# Altium project box_NU.PrjPCB
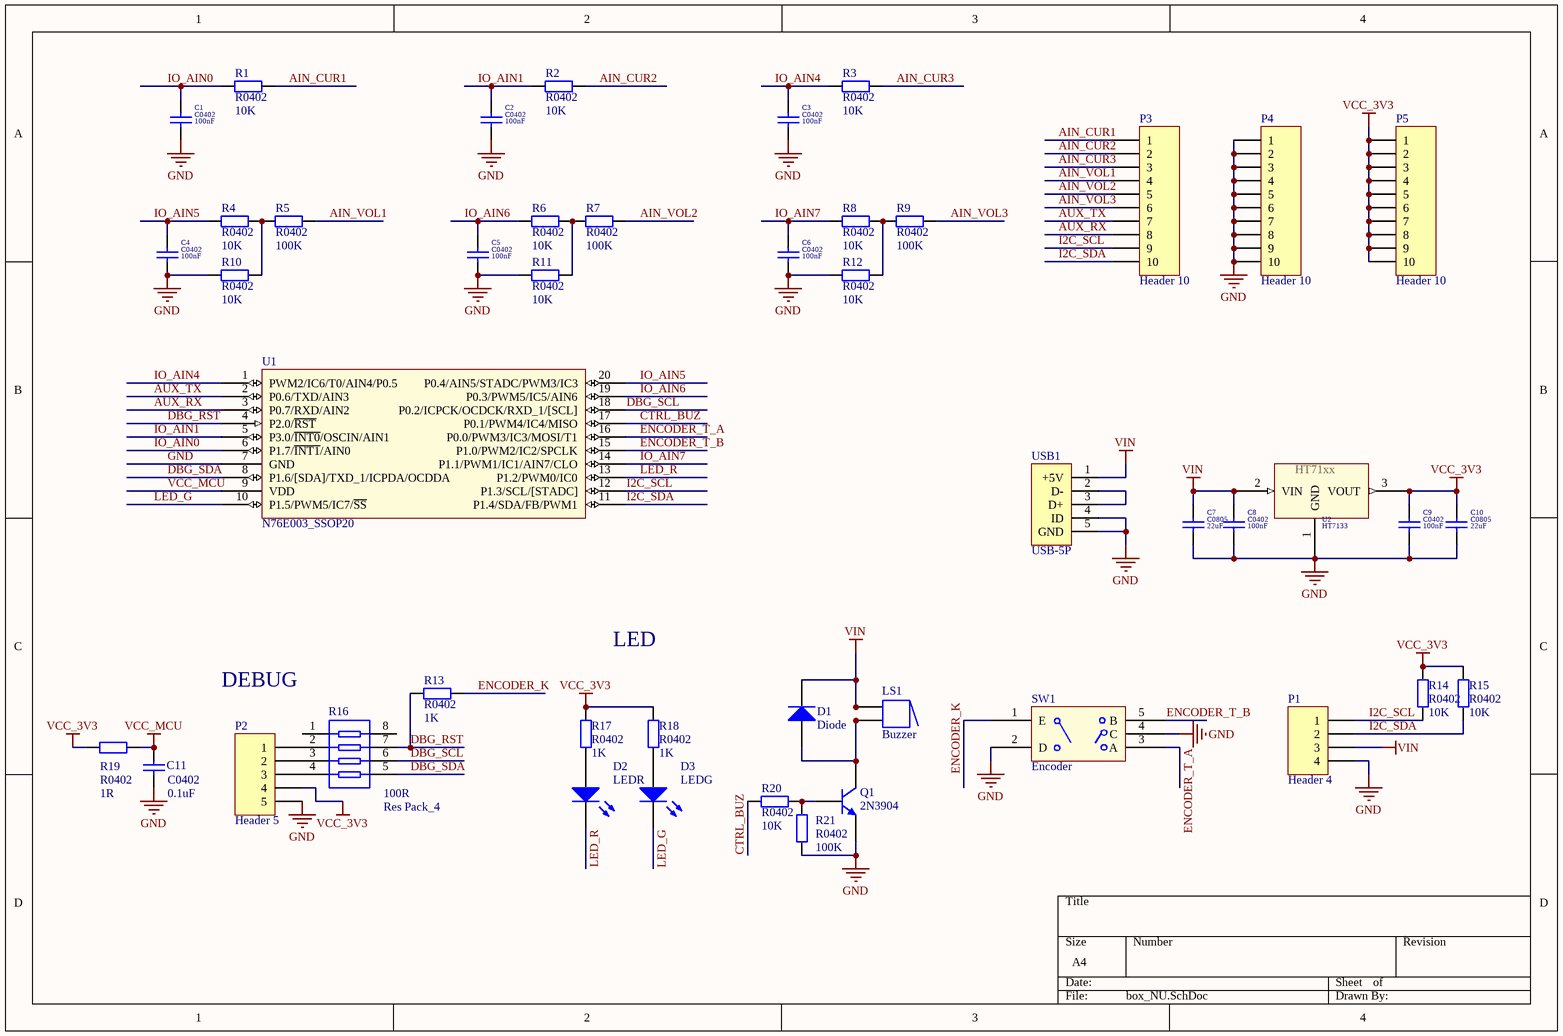
[diagram p0: box_NU.SchDoc]
1 sheet, 46 parts. Net scope: global (net labels, ports and power ports of the same name join across sheets).

## Sheet box_NU.SchDoc
size A4

### Parts
C1  C0402  value 100nF  [C 0402]
C2  C0402  value 100nF  [C 0402]
C3  C0402  value 100nF  [C 0402]
C4  C0402  value 100nF  [C 0402]
C5  C0402  value 100nF  [C 0402]
C6  C0402  value 100nF  [C 0402]
C7  C0805  value 22uF  [C 0805]
C8  C0402  value 100nF  [C 0402]
C9  C0402  value 100nF  [C 0402]
C10  C0805  value 22uF  [C 0805]
C11  C0402  value 0.1uF  [C 0402]
D1  Diode  [SMC]
D2  LEDR  [LED 0603B]
D3  LEDG  [LED 0603B]
LS1  Buzzer  [ABSM-1574]
P1  Header 4  [HDR1X4]
P2  Header 5  [HDR1X5]
P3  Header 10  [HDR1X10]
P4  Header 10  [HDR1X10]
P5  Header 10  [HDR1X10]
Q1  2N3904  [TO-92A]
R1  R0402  value 10K  [R 0402]
R2  R0402  value 10K  [R 0402]
R3  R0402  value 10K  [R 0402]
R4  R0402  value 10K  [R 0402]
R5  R0402  value 100K  [R 0402]
R6  R0402  value 10K  [R 0402]
R7  R0402  value 100K  [R 0402]
R8  R0402  value 10K  [R 0402]
R9  R0402  value 100K  [R 0402]
R10  R0402  value 10K  [R 0402]
R11  R0402  value 10K  [R 0402]
R12  R0402  value 10K  [R 0402]
R13  R0402  value 1K  [R 0402]
R14  R0402  value 10K  [R 0402]
R15  R0402  value 10K  [R 0402]
R16  Res Pack_4  value 100R
R17  R0402  value 1K  [R 0402]
R18  R0402  value 1K  [R 0402]
R19  R0402  value 1R  [R 0402]
R20  R0402  value 10K  [R 0402]
R21  R0402  value 100K  [R 0402]
SW1  Encoder
U1  N76E003_SSOP20  [SSOP20]
U2  HT7133  [SOT89_M]
USB1  USB-5P  [USB-MICRO_A]

### Nets
GND: C1.1 C2.1 C3.1 C4.1 C5.1 C6.1 C7.1 C8.1 C9.1 C10.1 C11.1 P1.4 P2.5 P4.1 P4.2 P4.3 P4.4 P4.5 P4.6 P4.7 P4.8 P4.9 P4.10 Q1.1(E) R10.2 R11.2 R12.2 R21.2 SW1.2(D) SW1.4(C) U1.7(GND) U2.1(GND) USB1.4(ID) USB1.5(GND)
VCC_3V3: C9.2 C10.2 P2.4 P5.1 P5.2 P5.3 P5.4 P5.5 P5.6 P5.7 P5.8 P5.9 P5.10 R14.1 R15.1 R17.2 R18.2 R19.1 U2.3(VOUT)
VCC_MCU: C11.2 R19.2 U1.9(VDD)
VIN: C7.2 C8.2 D1.2(K) LS1.1 LS1.1A P1.3 U2.2(VIN) USB1.1(+5V)
AIN_CUR1: P3.1 R1.2
AIN_CUR2: P3.2 R2.2
AIN_CUR3: P3.3 R3.2
AIN_VOL1: P3.4 R5.1
AIN_VOL2: P3.5 R7.1
AIN_VOL3: P3.6 R9.1
AUX_RX: P3.8 U1.3(P0.7/RXD/AIN2)
AUX_TX: P3.7 U1.2(P0.6/TXD/AIN3)
CTRL_BUZ: R20.2 U1.17(P0.1/PWM4/IC4/MISO)
DBG_RST: R13.2 R16.7 U1.4(P2.0/~{RST})
DBG_SCL: R16.6 U1.18(P0.2/ICPCK/OCDCK/RXD_1/[SCL])
DBG_SDA: R16.5 U1.8(P1.6/[SDA]/TXD_1/ICPDA/OCDDA)
ENCODER_K: R13.1 SW1.1(E)
ENCODER_T_A: SW1.3(A) U1.16(P0.0/PWM3/IC3/MOSI/T1)
ENCODER_T_B: SW1.5(B) U1.15(P1.0/PWM2/IC2/SPCLK)
I2C_SCL: P1.1 P3.9 R14.2 U1.12(P1.3/SCL/[STADC])
I2C_SDA: P1.2 P3.10 R15.2 U1.11(P1.4/SDA/FB/PWM1)
IO_AIN0: C1.2 R1.1 U1.6(P1.7/~{INT1}/AIN0)
IO_AIN1: C2.2 R2.1 U1.5(P3.0/~{INT0}/OSCIN/AIN1)
IO_AIN4: C3.2 R3.1 U1.1(PWM2/IC6/T0/AIN4/P0.5)
IO_AIN5: C4.2 R4.1 U1.20(P0.4/AIN5/STADC/PWM3/IC3)
IO_AIN6: C5.2 R6.1 U1.19(P0.3/PWM5/IC5/AIN6)
IO_AIN7: C6.2 R8.1 U1.14(P1.1/PWM1/IC1/AIN7/CLO)
LED_G: D3.2(K) U1.10(P1.5/PWM5/IC7/~{SS})
LED_R: D2.2(K) U1.13(P1.2/PWM0/IC0)
NetD1_1: D1.1(A) LS1.2 LS1.2A Q1.3(C)
NetD2_1: D2.1(A) R17.1
NetD3_1: D3.1(A) R18.1
NetP2_1: P2.1 R16.2
NetP2_2: P2.2 R16.3
NetP2_3: P2.3 R16.4
NetQ1_2: Q1.2(B) R20.1 R21.1
NetR4_2: R4.2 R5.2 R10.1
NetR6_2: R6.2 R7.2 R11.1
NetR8_2: R8.2 R9.2 R12.1
NetUSB1_2: USB1.2(D-) USB1.3(D+)

Not connected (* = marked no-connect by the designer): R16 1 8

### Notes on the sheet
- LED
- DEBUG

### Library data of the parts
C1-C11 = Cap: Capacitor; Published: 8-Jun-2000; LatestRevisionDate: 17-Jul-2002; LatestRevisionNote: Re-released for DXP Platform.; PackageReference: RAD-0.3; Publisher: Altium Limited; PackageDescription: Radial Cap, Thru-Hole; 2 Leads; 0.3 in Pin Spacing
D1 = Diode: Default Diode; Published: 8-Jun-2000; LatestRevisionDate: 17-Jul-2002; LatestRevisionNote: Re-released for DXP Platform.; PackageVersion: Sep-1996; PackageReference: SMC; Publisher: Altium Limited; PackageDescription: DO-214-AB/SMC; 2 C-Bend Leads; Body 7.9 x 5.9 mm, inc. leads (LxW); Code_JEDEC: DO-214-AB
D2 D3 = LED0: Typical INFRARED GaAs LED; Published: 8-Jun-2000; LatestRevisionDate: 08-Jul-2005; LatestRevisionNote: Mech Layer 1 removed.; PackageReference: LED-0; Publisher: Altium Limited; PackageDescription: LED; 2 Leads
LS1 = Buzzer: Magnetic Transducer Buzzer; Published: 24-Mar-1999; LatestRevisionDate: 17-Dec-2003; LatestRevisionNote: Schematic revised, PCB Footprint replaced.; DatasheetVersion: 17-Dec-2003; PackageReference: ABSM-1574; Publisher: Altium Limited; PackageDescription: Magnetic Transducer Buzzer; ComponentLink1Description: Manufacturer Link; ComponentLink1URL: http://www.megastar.com/linecard/buzzmode/index.php
P1 = Header 4: Header, 4-Pin; LatestRevisionDate: 17-Jul-2002; LatestRevisionNote: Re-released for DXP Platform.; Publisher: Altium Limited
P2 = Header 5: Header, 5-Pin; LatestRevisionDate: 17-Jul-2002; LatestRevisionNote: Re-released for DXP Platform.; Publisher: Altium Limited
P3-P5 = Header 10: Header, 10-Pin; LatestRevisionDate: 17-Jul-2002; LatestRevisionNote: Re-released for DXP Platform.; Publisher: Altium Limited
Q1 = 2N3904: NPN General Purpose Amplifier; Published: 8-Jun-2000; LatestRevisionDate: 15-Jan-2003; LatestRevisionNote: PCB Footprint 'BCY-W3/D4.7' replaced; DatasheetVersion: 1997; PackageVersion: Sep-1998; PackageReference: TO-92A; Publisher: Altium Limited; PackageDescription: TO, Flat Index; 3 In-Line, Axial Leads; Body Dia. 4.5mm; Leads 0.51 x 0.48 mm (max); ComponentLink1Description: Manufacturer Link; ComponentLink1URL: http://www.fairchildsemi.com/; ComponentLink2Description: Datasheet; ComponentLink2URL: http://www.fairchildsemi.com/ds/2N%2F2N3904.pdf
R1-R15 R17-R21 = Res2: Resistor; Published: 8-Jun-2000; LatestRevisionDate: 17-Jul-2002; LatestRevisionNote: Re-released for DXP Platform.; PackageReference: AXIAL-0.4; Publisher: Altium Limited; PackageDescription: Axial Device, Thru-Hole; 2 Leads; 0.4 in Pin Spacing
R16 = Res Pack_4: Isolated Resistor Network; Published: 24-Mar-1999; LatestRevisionDate: 29-May-2009; LatestRevisionNote: IPC-7351 Footprint Added.; PackageVersion: Oct-2003; PackageReference: SSOP16; Publisher: Altium Limited; PackageDescription: 16-Pin Plastic Small Outline Package 0.65 mm Pitch; Code_JEDEC: MO-150-AC; Code_IPC: SOP65P780-16
SW1 = EC11: 编码器EC11
U1 = N76E003_SSOP20: nuvoton mcu, 20pin
U2 = HT71xx: Value: 3.3V
USB1 = USB-5P: 微型USB母座; 版权归属: 源创客; BOM名称: 微型USB母座; 学习资源: www.ooocke.com